# Altium schematic sheet Transceiver.SchDoc
size A4
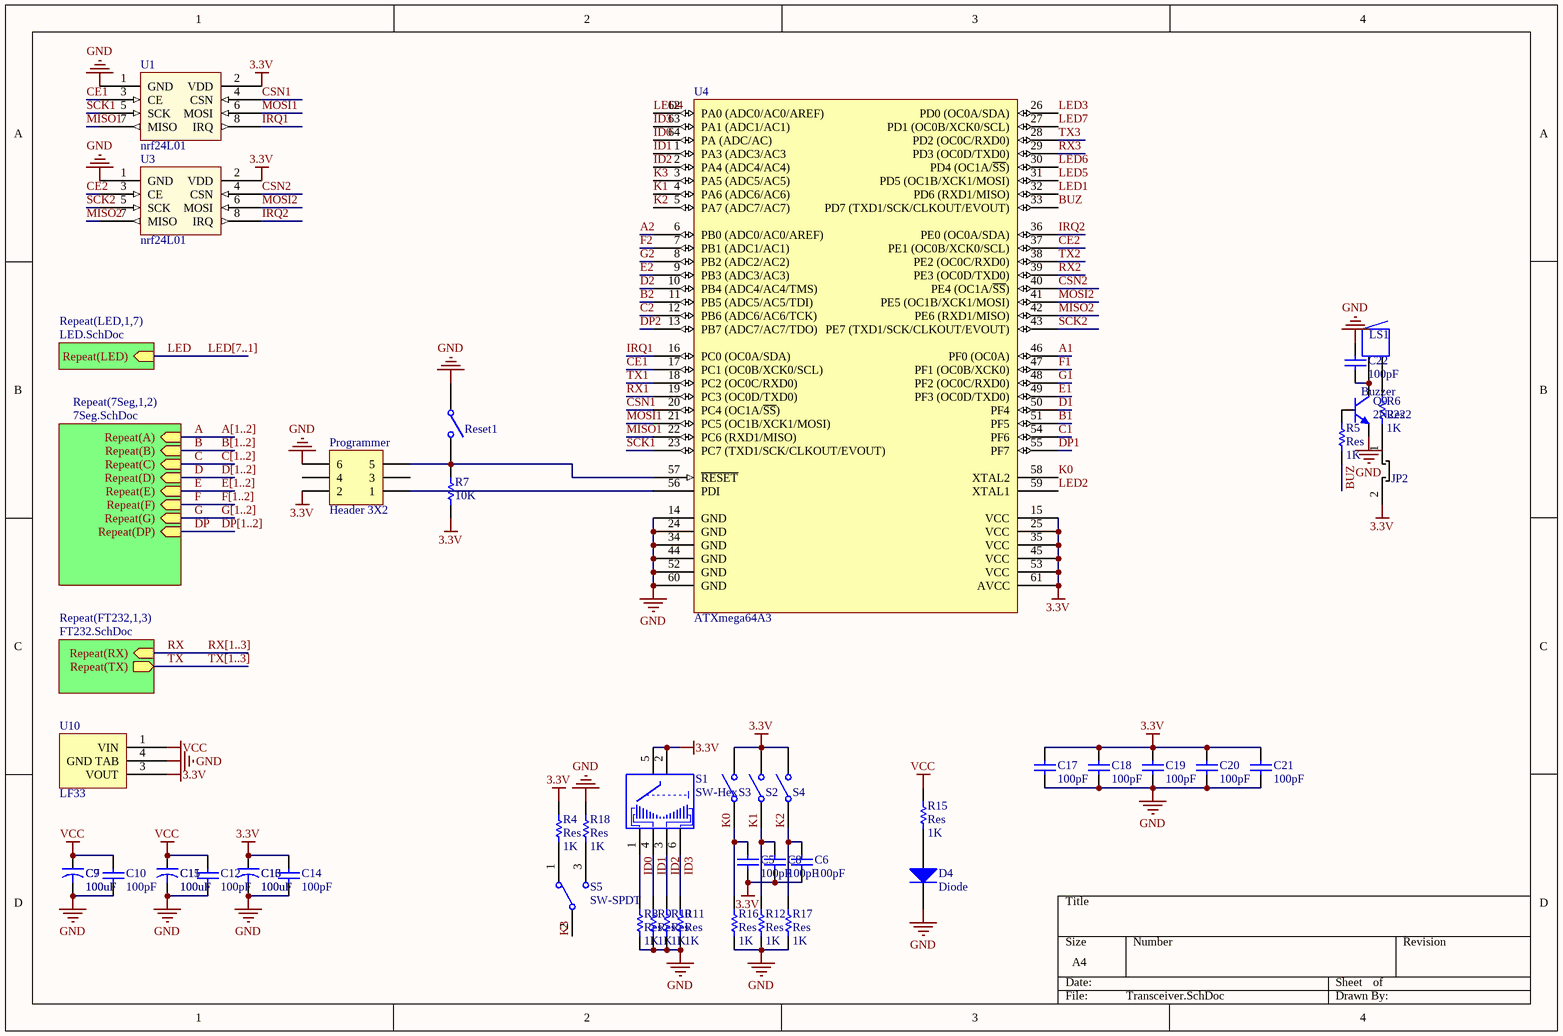
[diagram p0: Transceiver.SchDoc]

## Parts
C5  value 100pF  [2012[0805]]  (hidden comment: Cap_UP)
C6  value 100pF  [2012[0805]]  (hidden comment: Cap_UP)
C7  value 100uF  [EL_M]  (hidden comment: Cap_El)
C8  value 100pF  [2012[0805]]  (hidden comment: Cap_UP)
C9  value 100uF  [EL_M]  (hidden comment: Cap_El)
C10  value 100pF  [2012[0805]]  (hidden comment: Cap_UP)
C11  value 100uF  [EL_M]  (hidden comment: Cap_El)
C12  value 100pF  [2012[0805]]  (hidden comment: Cap_UP)
C13  value 100uF  [EL_M]  (hidden comment: Cap_El)
C14  value 100pF  [2012[0805]]  (hidden comment: Cap_UP)
C15  value 100uF  [EL_M]  (hidden comment: Cap_El)
C16  value 100uF  [EL_M]  (hidden comment: Cap_El)
C17  value 100pF  [2012[0805]]  (hidden comment: Cap_UP)
C18  value 100pF  [2012[0805]]  (hidden comment: Cap_UP)
C19  value 100pF  [2012[0805]]  (hidden comment: Cap_UP)
C20  value 100pF  [2012[0805]]  (hidden comment: Cap_UP)
C21  value 100pF  [2012[0805]]  (hidden comment: Cap_UP)
C22  value 100pF  [2012[0805]]  (hidden comment: Cap_UP)
D4  Diode  [2012[0805]]
JP2  JUMPER  [HDR1X2]  (value not drawn)
LS1  Buzzer  [BUZZER]
Programmer  Header 3X2  [HDRBOX2X3]
Q9  2N2222  [SOT-23]
R4  Res  value 1K  [2012[0805]]
R5  Res  value 1K  [2012[0805]]
R6  Res  value 1K  [2012[0805]]
R7  10K  [2012[0805]]
R8  Res  value 1K  [2012[0805]]
R9  Res  value 1K  [2012[0805]]
R10  Res  value 1K  [2012[0805]]
R11  Res  value 1K  [2012[0805]]
R12  Res  value 1K  [2012[0805]]
R15  Res  value 1K  [2012[0805]]
R16  Res  value 1K  [2012[0805]]
R17  Res  value 1K  [2012[0805]]
R18  Res  value 1K  [2012[0805]]
Reset1  SW-SPST  [PUSH-BUT]  (value not drawn)
S1  SW-Hex  [SW-HEX]
S2  SW-SPST  [PUSH-BUT-SMD]  (value not drawn)
S3  SW-SPST  [PUSH-BUT]  (value not drawn)
S4  SW-SPST  [PUSH-BUT]  (value not drawn)
S5  SW-SPDT  [SW-SPDT]
U1  nrf24L01  [NRF24L01+PA+LNA]
U3  nrf24L01  [NRF24L01+PA+LNA]
U4  ATXmega64A3  [64A_N]
U10  LF33  [D-PACK]

## Sub-sheets
Repeat(7Seg,1,2) = 7Seg.SchDoc: Repeat(A) (in), Repeat(B) (in), Repeat(C) (in), Repeat(D) (in), Repeat(E) (in), Repeat(F) (in), Repeat(G) (in), Repeat(DP) (in)
Repeat(FT232,1,3) = FT232.SchDoc: Repeat(RX) (in), Repeat(TX) (out)
Repeat(LED,1,7) = LED.SchDoc: Repeat(LED) (in)

## Nets
3.3V: C5.2 C6.2 C8.2 C13.1 C14.2 C16.1 C17.2 C18.2 C19.2 C20.2 C21.2 JP2.2 Programmer.2 R4.2 R7.1 S1.2 S1.5 S2.2(NO) S3.2(NO) S4.2(NO) U1.2(VDD) U3.2(VDD) U4.15(VCC) U4.25(VCC) U4.35(VCC) U4.45(VCC) U4.53(VCC) U4.61(AVCC) U10.3(VOUT)
GND: C7.2 C9.2 C10.1 C11.2 C12.1 C13.2 C14.1 C15.2 C16.2 C17.1 C18.1 C19.1 C20.1 C21.1 C22.2 D4.2(K) Programmer.6 Q9.3(E) R8.1 R9.1 R10.1 R11.1 R12.1 R16.1 R17.1 R18.2 Reset1.1(COMMON) U1.1(GND) U3.1(GND) U4.14(GND) U4.24(GND) U4.34(GND) U4.44(GND) U4.52(GND) U4.60(GND) U10.4(GND_TAB)
VCC: C7.1 C9.1 C10.2 C11.1 C12.2 C15.1 R15.1 U10.1(VIN)
A: sheet Repeat(7Seg,1,2)/Repeat(A)
A1: U4.46(PF0_(OC0A))
A2: U4.6(PB0_(ADC0/AC0/AREF))
B: sheet Repeat(7Seg,1,2)/Repeat(B)
B1: U4.51(PF5)
B2: U4.11(PB5_(ADC5/AC5/TDI))
BUZ: R5.2 U4.33(PD7_(TXD1/SCK/CLKOUT/EVOUT))
C: sheet Repeat(7Seg,1,2)/Repeat(C)
C1: U4.54(PF6)
C2: U4.12(PB6_(ADC6/AC6/TCK))
CE1: U1.3(CE) U4.17(PC1_(OC0B/XCK0/SCL))
CE2: U3.3(CE) U4.37(PE1_(OC0B/XCK0/SCL))
CSN1: U1.4(CSN) U4.20(PC4_(OC1A/~{SS}))
CSN2: U3.4(CSN) U4.40(PE4_(OC1A/~{SS}))
D: sheet Repeat(7Seg,1,2)/Repeat(D)
D1: U4.50(PF4)
D2: U4.10(PB4_(ADC4/AC4/TMS))
DP: sheet Repeat(7Seg,1,2)/Repeat(DP)
DP1: U4.55(PF7)
DP2: U4.13(PB7_(ADC7/AC7/TDO))
E: sheet Repeat(7Seg,1,2)/Repeat(E)
E1: U4.49(PF3_(OC0D/TXD0))
E2: U4.9(PB3_(ADC3/AC3))
F: sheet Repeat(7Seg,1,2)/Repeat(F)
F1: U4.47(PF1_(OC0B/XCK0))
F2: U4.7(PB1_(ADC1/AC1))
G: sheet Repeat(7Seg,1,2)/Repeat(G)
G1: U4.48(PF2_(OC0C/RXD0))
G2: U4.8(PB2_(ADC2/AC2))
ID0: R8.2 S1.1 U4.64(PA_(ADC/AC))
ID1: R9.2 S1.4 U4.1(PA3_(ADC3/AC3)
ID2: R10.2 S1.3 U4.2(PA4_(ADC4/AC4))
ID3: R11.2 S1.6 U4.63(PA1_(ADC1/AC1))
IRQ1: U1.8(IRQ) U4.16(PC0_(OC0A/SDA))
IRQ2: U3.8(IRQ) U4.36(PE0_(OC0A/SDA))
K0: C5.1 R16.2 S3.1(COMMON) U4.58(XTAL2)
K1: C8.1 R12.2 S2.1(COMMON) U4.4(PA6_(ADC6/AC6))
K2: C6.1 R17.2 S4.1(COMMON) U4.5(PA7_(ADC7/AC7))
K3: S5.2 U4.3(PA5_(ADC5/AC5))
LED: sheet Repeat(LED,1,7)/Repeat(LED)
LED1: U4.32(PD6_(RXD1/MISO))
LED2: U4.59(XTAL1)
LED3: U4.26(PD0_(OC0A/SDA))
LED4: U4.62(PA0_(ADC0/AC0/AREF))
LED5: U4.31(PD5_(OC1B/XCK1/MOSI))
LED6: U4.30(PD4_(OC1A/~{SS}))
LED7: U4.27(PD1_(OC0B/XCK0/SCL))
MISO1: U1.7(MISO) U4.22(PC6_(RXD1/MISO))
MISO2: U3.7(MISO) U4.42(PE6_(RXD1/MISO))
MOSI1: U1.6(MOSI) U4.21(PC5_(OC1B/XCK1/MOSI))
MOSI2: U3.6(MOSI) U4.41(PE5_(OC1B/XCK1/MOSI))
RX: sheet Repeat(FT232,1,3)/Repeat(RX)
RX1: U4.19(PC3_(OC0D/TXD0))
RX2: U4.39(PE3_(OC0D/TXD0))
RX3: U4.29(PD3_(OC0D/TXD0))
SCK1: U1.5(SCK) U4.23(PC7_(TXD1/SCK/CLKOUT/EVOUT))
SCK2: U3.5(SCK) U4.43(PE7_(TXD1/SCK/CLKOUT/EVOUT))
TX: sheet Repeat(FT232,1,3)/Repeat(TX)
TX1: U4.18(PC2_(OC0C/RXD0))
TX2: U4.38(PE2_(OC0C/RXD0))
TX3: U4.28(PD2_(OC0C/RXD0))
NetC22_1: C22.1 LS1.1 Q9.1(C)
NetD4_1: D4.1(A) R15.2
NetJP2_1: JP2.1 R6.2
NetLS1_2: LS1.2 R6.1
NetProgrammer_1: Programmer.1 U4.56(PDI)
NetProgrammer_5: Programmer.5 R7.2 Reset1.2(NO) U4.57(~{RESET})
NetQ9_2: Q9.2(B) R5.1
NetR4_1: R4.1 S5.1
NetR18_1: R18.1 S5.3

Not connected (* = marked no-connect by the designer): Programmer 3 4

## Buses and harness runs
bus A[1..2]
bus B[1..2]
bus C[1..2]
bus D[1..2]
bus DP[1..2]
bus E[1..2]
bus F[1..2]
bus G[1..2]
bus LED[7..1]
bus RX[1..3]
bus TX[1..3]

## Library data of the parts
C5 C6 C8 C10 C12 C14 C17-C22 = Cap_UP: Capacitor; Published: 8-Jun-2000; LatestRevisionDate: 17-Jul-2002; LatestRevisionNote: Re-released for DXP Platform.; PackageReference: RAD-0.3; Publisher: Altium Limited
C7 C9 C11 C13 C15 C16 = Cap_El: Capacitor; Published: 23-Sep-2002; PackageReference: CAPR5-4X5; Publisher: Altium Limited
D4 = Diode: 1 Amp General Purpose Rectifier; Revision 1: 11-Jul-2000: SIM Model Added.; Revision 2: 17-Jul-2002: Re-released for DXP Platform.; Package Information: Latest Revision: Aug-1999; Code - JEDEC: DO-204-AL; Published: 8-Jun-2000; Datasheet: Latest Revision: 1998; Package Reference: DO-41; Publisher: Altium Limited
LS1 = Buzzer: Magnetic Transducer Buzzer; Published: 24-Mar-1999; LatestRevisionDate: 17-Dec-2003; LatestRevisionNote: Schematic revised, PCB Footprint replaced.; DatasheetDocument: 17-Dec-2003; PackageReference: ABSM-1574; Publisher: Altium Limited; ComponentLink1Description: Manufacturer Link; ComponentLink1URL: http://www.megastar.com/linecard/buzzmode/index.php
Programmer = Header 3X2: Header, 3-Pin, Dual row; LatestRevisionDate: 17-Jul-2002; LatestRevisionNote: Re-released for DXP Platform.; Publisher: Altium Limited
Q9 = 2N2222: NPN Bipolar Transistor; Published: 8-Jun-2000; LatestRevisionDate: 17-Jul-2002; LatestRevisionNote: Re-released for DXP Platform.; PackageReference: TO-226; Publisher: Altium Limited; Code_JEDEC: TO-226-AA
R4-R12 R15-R18 = Res: Semiconductor Resistor; Published: 8-Jun-2000; LatestRevisionDate: 17-Jul-2002; LatestRevisionNote: Re-released for DXP Platform.; PackageReference: AXIAL-0.5; Publisher: Altium Limited
Reset1 S2-S4 = SW-SPST: Single-Pole, Single-Throw Switch; Published: 24-Mar-1999; Revision: July-2002: Re-released for DXP Platform.; Publisher: Altium Limited
S5 = SW-SPDT: SPDT Subminiature Toggle Switch, Right Angle Mounting, Vertical Actuation; Published: 24-Mar-1999; LatestRevisionDate: 17-Dec-2003; LatestRevisionNote: Schematic revised, PCB Footprint replaced.; DatasheetDocument: 05-Dec-2000; PackageReference: TL36WW15050; Publisher: Altium Limited; ComponentLink1Description: Manufacturer Link; ComponentLink1URL: http://www.apem.com
U10 = 7805
S1 = SW-Hex: Published: 24-Mar-1999; LatestRevisionDate: 17-Jul-2002; LatestRevisionNote: Re-released for DXP Platform.; PackageReference: DIP-8; Publisher: Altium Limited